# EAGLE design dc26_maneki-neko_badge_VERSION2 (EAGLE 9.1.3)
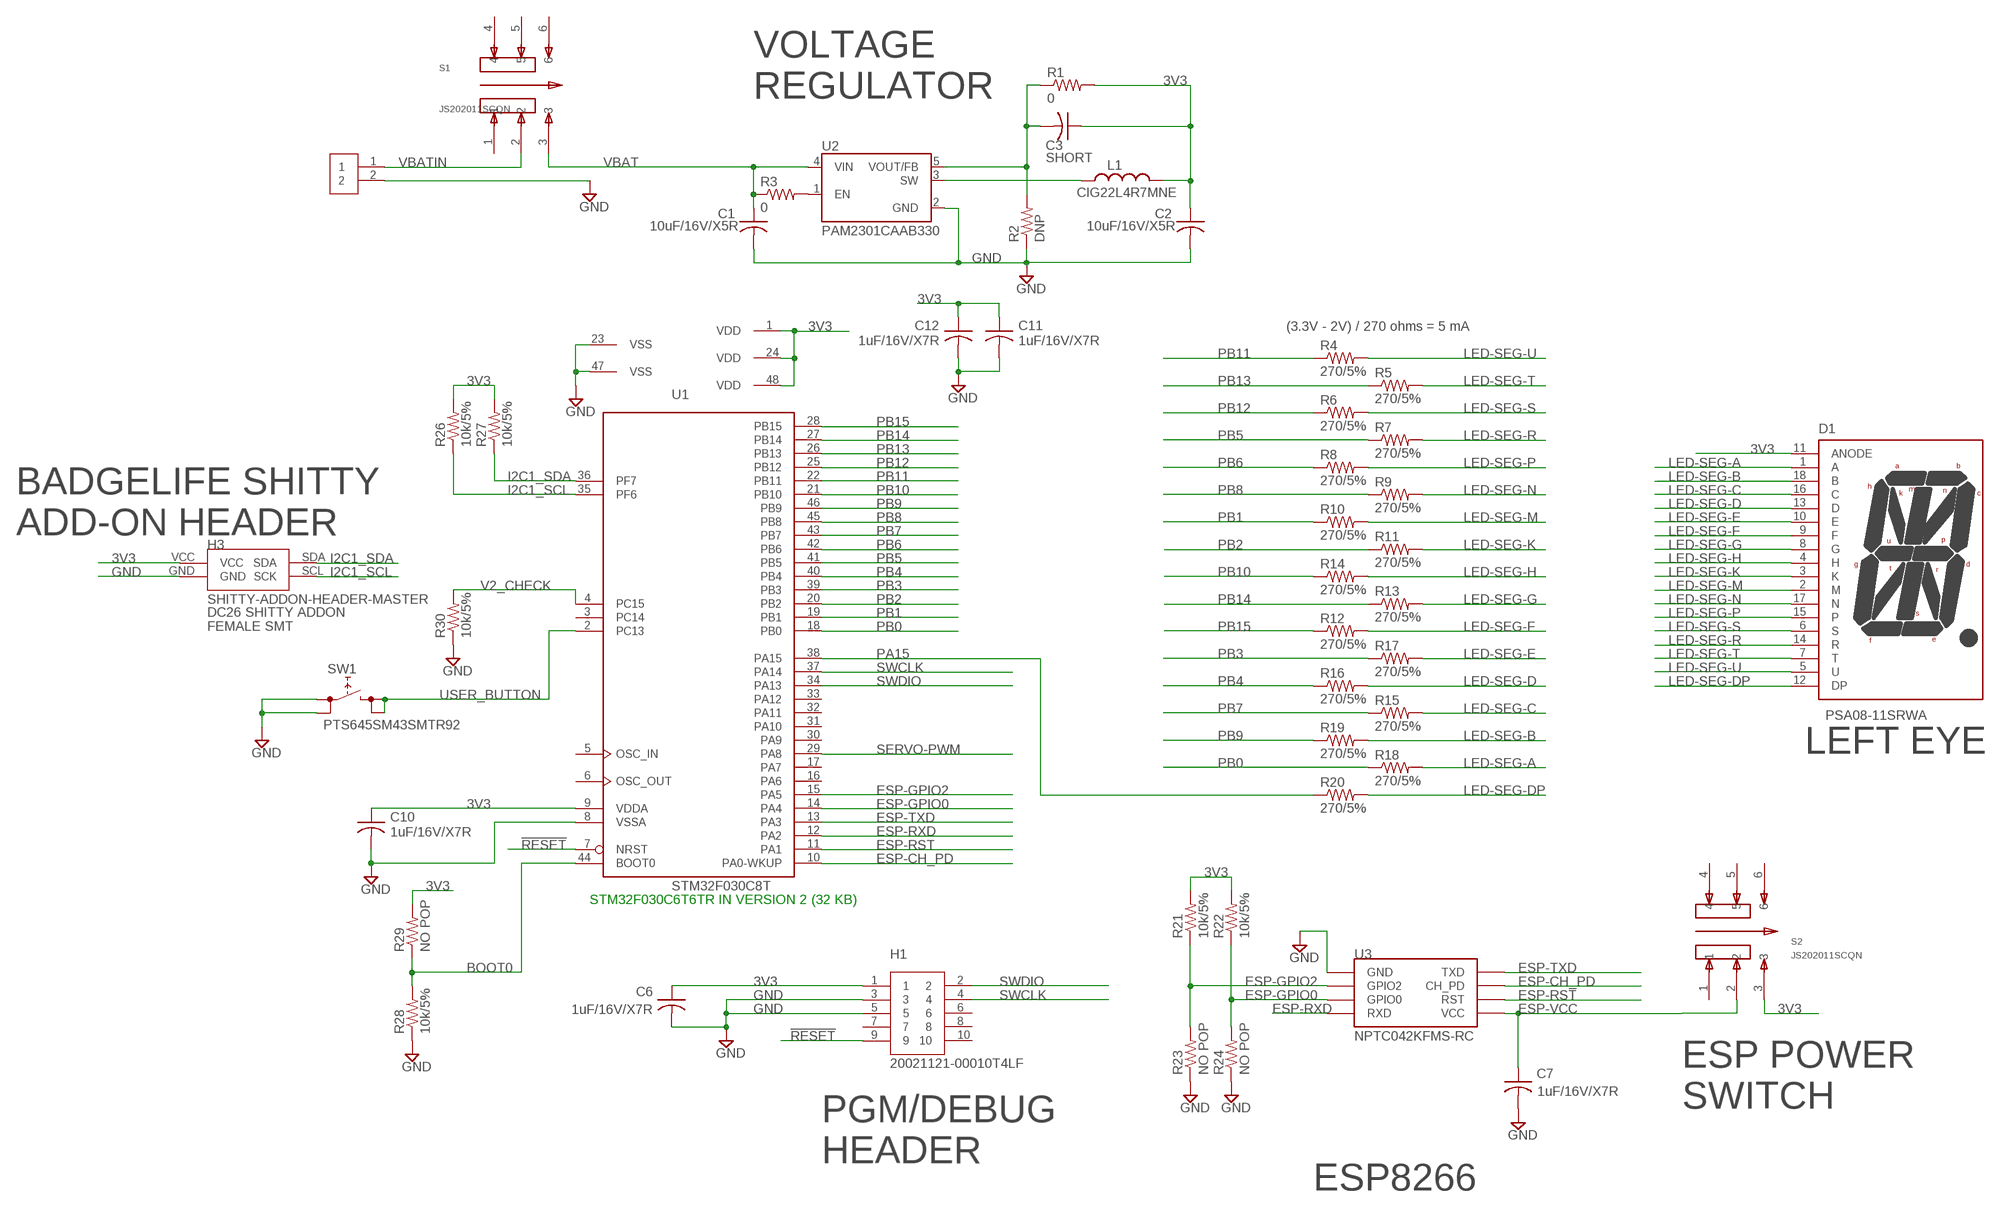
[diagram p0: schematic, sheet 1, part 1 of 2]
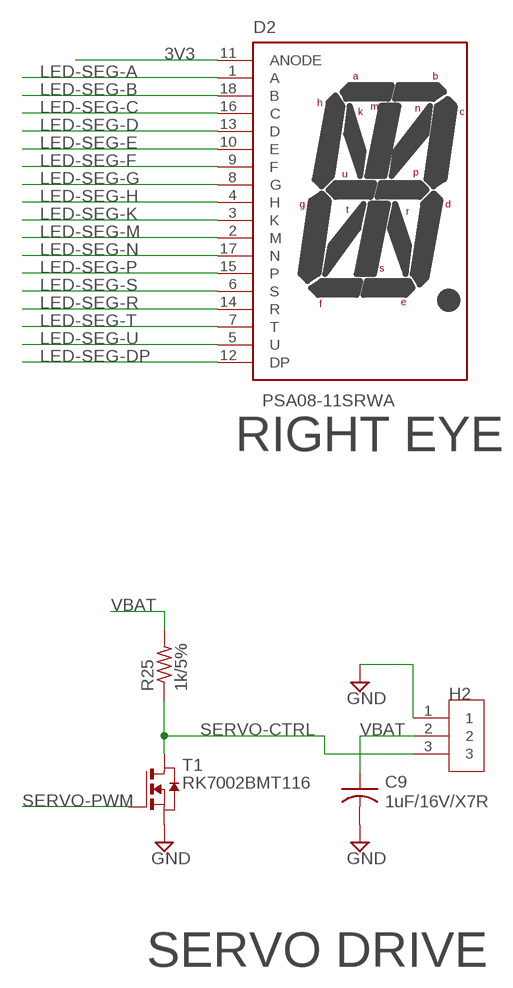
[diagram p1: schematic, sheet 1, part 2 of 2]

## Parts
C1  10uF/16V/X5R  C-USC0805  [C0805]
C2  10uF/16V/X5R  C-USC0805  [C0805]
C3  SHORT  C-USC0805  [C0805]
C6  1uF/16V/X7R  C-USC0805  [C0805]
C7  1uF/16V/X7R  C-USC0805  [C0805]
C9  1uF/16V/X7R  C-USC0805  [C0805]
C10  1uF/16V/X7R  C-USC0805  [C0805]
C11  1uF/16V/X7R  C-USC0805  [C0805]
C12  1uF/16V/X7R  C-USC0805  [C0805]
D1  PSA08-11SRWA  [PSA08-11SRWA]
D2  PSA08-11SRWA  [PSA08-11SRWA]
H1  20021121-00010T4LF  [20021121-00010T4LF]
H2  M20-8890345R  [M20-8890345R]
H3  SHITTY-ADDON-HEADER-MASTER  [2X2-0.1INCH-FEMALE-SMT]
H4  BATTPADS-SMT  [BATTPADS-SMT]
L1  CIG22L4R7MNE  [L-1008-US]
R1  0  R-US_R0805  [R0805]
R2  DNP  R-US_R0805  [R0805]
R3  0  R-US_R0805  [R0805]
R4  270/5%  R-US_R0805  [R0805]
R5  270/5%  R-US_R0805  [R0805]
R6  270/5%  R-US_R0805  [R0805]
R7  270/5%  R-US_R0805  [R0805]
R8  270/5%  R-US_R0805  [R0805]
R9  270/5%  R-US_R0805  [R0805]
R10  270/5%  R-US_R0805  [R0805]
R11  270/5%  R-US_R0805  [R0805]
R12  270/5%  R-US_R0805  [R0805]
R13  270/5%  R-US_R0805  [R0805]
R14  270/5%  R-US_R0805  [R0805]
R15  270/5%  R-US_R0805  [R0805]
R16  270/5%  R-US_R0805  [R0805]
R17  270/5%  R-US_R0805  [R0805]
R18  270/5%  R-US_R0805  [R0805]
R19  270/5%  R-US_R0805  [R0805]
R20  270/5%  R-US_R0805  [R0805]
R21  10k/5%  R-US_R0805  [R0805]
R22  10k/5%  R-US_R0805  [R0805]
R23  NO POP  R-US_R0805  [R0805]
R24  NO POP  R-US_R0805  [R0805]
R25  1k/5%  R-US_R0805  [R0805]
R26  10k/5%  R-US_R0805  [R0805]
R27  10k/5%  R-US_R0805  [R0805]
R28  10k/5%  R-US_R0805  [R0805]
R29  NO POP  R-US_R0805  [R0805]
R30  10k/5%  R-US_R0805  [R0805]
S1  JS202011SCQN  [SW_JS202011SCQN]
S2  JS202011SCQN  [SW_JS202011SCQN]
SW1  PTS645SM43SMTR92  [PTS645SM43SMTR92]
T1  RK7002BMT116  NMOSSOT23  [SOT-23]
U1  STM32F030C8T  [LQFP48]
U2  PAM2301CAAB330  [SOT95P280X100-5N]
U3  NPTC042KFMS-RC  [NPTC042KFMS-RC]

## Nets
3V3: C2.1 C3.1 C6.1 C10.1 C11.1 C12.1 D1.11(ANODE) D2.11(ANODE) H1.1 H3.VCC L1.P$2 R1.2 R21.2 R22.2 R26.2 R27.2 R29.2 S2.3 U1.1(VDD) U1.9(VDDA) U1.24(VDD) U1.48(VDD)
!RESET: H1.9 U1.7(NRST)
BOOT0: R28.2 R29.1 U1.44(BOOT0)
ESP-CH_PD: U1.10(PA0-WKUP) U3.3(CH_PD)
ESP-GPIO0: R22.1 R24.2 U1.14(PA4) U3.6(GPIO0)
ESP-GPIO2: R21.1 R23.2 U1.15(PA5) U3.4(GPIO2)
ESP-RST: U1.11(PA1) U3.5(RST)
ESP-RXD: U1.12(PA2) U3.8(RXD)
ESP-TXD: U1.13(PA3) U3.1(TXD)
ESP-VCC: C7.1 S2.2 U3.7(VCC)
GND: C1.2 C2.2 C6.2 C7.2 C9.2 C10.2 C11.2 C12.2 H1.3 H1.5 H2.1 H3.GND H4.2 R2.1 R23.1 R24.1 R28.1 R30.1 SW1.1 SW1.2 T1.2(S) U1.8(VSSA) U1.23(VSS) U1.47(VSS) U2.2(GND) U3.2(GND)
I2C1_SCL: H3.SCL(SCK) R26.1 U1.35(PF6)
I2C1_SDA: H3.SDA R27.1 U1.36(PF7)
LED-SEG-A: D1.1(A) D2.1(A) R18.2
LED-SEG-B: D1.18(B) D2.18(B) R19.2
LED-SEG-C: D1.16(C) D2.16(C) R15.2
LED-SEG-D: D1.13(D) D2.13(D) R16.2
LED-SEG-DP: D1.12(DP) D2.12(DP) R20.2
LED-SEG-E: D1.10(E) D2.10(E) R17.2
LED-SEG-F: D1.9(F) D2.9(F) R12.2
LED-SEG-G: D1.8(G) D2.8(G) R13.2
LED-SEG-H: D1.4(H) D2.4(H) R14.2
LED-SEG-K: D1.3(K) D2.3(K) R11.2
LED-SEG-M: D1.2(M) D2.2(M) R10.2
LED-SEG-N: D1.17(N) D2.17(N) R9.2
LED-SEG-P: D1.15(P) D2.15(P) R8.2
LED-SEG-R: D1.14(R) D2.14(R) R7.2
LED-SEG-S: D1.6(S) D2.6(S) R6.2
LED-SEG-T: D1.7(T) D2.7(T) R5.2
LED-SEG-U: D1.5(U) D2.5(U) R4.2
N$1: L1.P$1 U2.3(SW)
N$2: R3.2 U2.1(EN)
N$3: C3.2 R1.1 R2.2 U2.5(VOUT/FB)
PA15: R20.1 U1.38(PA15)
PB0: R18.1 U1.18(PB0)
PB1: R10.1 U1.19(PB1)
PB2: R11.1 U1.20(PB2)
PB3: R17.1 U1.39(PB3)
PB4: R16.1 U1.40(PB4)
PB5: R7.1 U1.41(PB5)
PB6: R8.1 U1.42(PB6)
PB7: R15.1 U1.43(PB7)
PB8: R9.1 U1.45(PB8)
PB9: R19.1 U1.46(PB9)
PB10: R14.1 U1.21(PB10)
PB11: R4.1 U1.22(PB11)
PB12: R6.1 U1.25(PB12)
PB13: R5.1 U1.26(PB13)
PB14: R13.1 U1.27(PB14)
PB15: R12.1 U1.28(PB15)
SERVO-CTRL: H2.3 R25.1 T1.1(D)
SERVO-PWM: T1.3(G) U1.29(PA8)
SWCLK: H1.4 U1.37(PA14)
SWDIO: H1.2 U1.34(PA13)
USER_BUTTON: SW1.3 SW1.4 U1.2(PC13)
V2_CHECK: R30.2 U1.4(PC15)
VBAT: C1.1 C9.1 H2.2 R3.1 R25.2 S1.3 U2.4(VIN)
VBATIN: H4.1 S1.2
Unconnected: H1.6 H1.7 H1.8 H1.10 S1.1 S1.4 S1.5 S1.6 S2.1 S2.4 S2.5 S2.6 U1.3(PC14) U1.5(OSC_IN) U1.6(OSC_OUT) U1.16(PA6) U1.17(PA7) U1.30(PA9) U1.31(PA10) U1.32(PA11) U1.33(PA12)

## Notes on the sheet
- VOLTAGE
  REGULATOR
- (3.3V - 2V) / 270 ohms = 5 mA
- BADGELIFE SHITTY
  ADD-ON HEADER
- LEFT EYE | RIGHT EYE
- STM32F030C6T6TR IN VERSION 2 (32 KB)
- ESP POWER
  SWITCH
- SERVO DRIVE
- PGM/DEBUG
  HEADER
- ESP8266

## Library data of the parts
C1-C3 C6 C7 C9-C12 = rcl:C-US: CAPACITOR, American symbol; SPICEPREFIX: C
D1 D2 = PSA08-11SRWA:PSA08-11SRWA
H1 = 20021121-00010T4LF:20021121-00010T4LF
H2 = M20-8890345R:M20-8890345R
H3 = dc26-shitty-addon:SHITTY-ADDON-HEADER-MASTER
H4 = battery_pads:BATTPADS-SMT
L1 = passives:CIG22L4R7MNE
R1-R30 = rcl:R-US_: RESISTOR, American symbol; SPICEPREFIX: R
S1 S2 = JS202011SCQN:JS202011SCQN: JS Series DPDT On-On Gull Wing Surface Mount Subminiature Slide Switch; AVAILABILITY: Good; DESCRIPTION: JS Series DPDT On-On Gull Wing Surface Mount Subminiature Slide Switch; MF: C&K Components; MP: JS202011SCQN; PACKAGE: None; PRICE: 0.33 USD
SW1 = PTS645SM43SMTR92:PTS645SM43SMTR92
T1 = zetex:NMOSSOT23: MOS FET; OC_FARNELL: unknown; OC_NEWARK: unknown
U1 = micro-stm_v3:STM32F030C*T: ARM 32-bit Cortex™-M0 CPU 48 MHz maximum frequency 32 to 64 Kbytes of Flash memory 4 to 8 kbytes of SRAM 39 GPIOs 2.4 to 3.6 V application supply
U2 = PAM2301CAAB120:PAM2301CAAB330
U3 = NPTC042KFMS-RC:NPTC042KFMS-RC

## Board
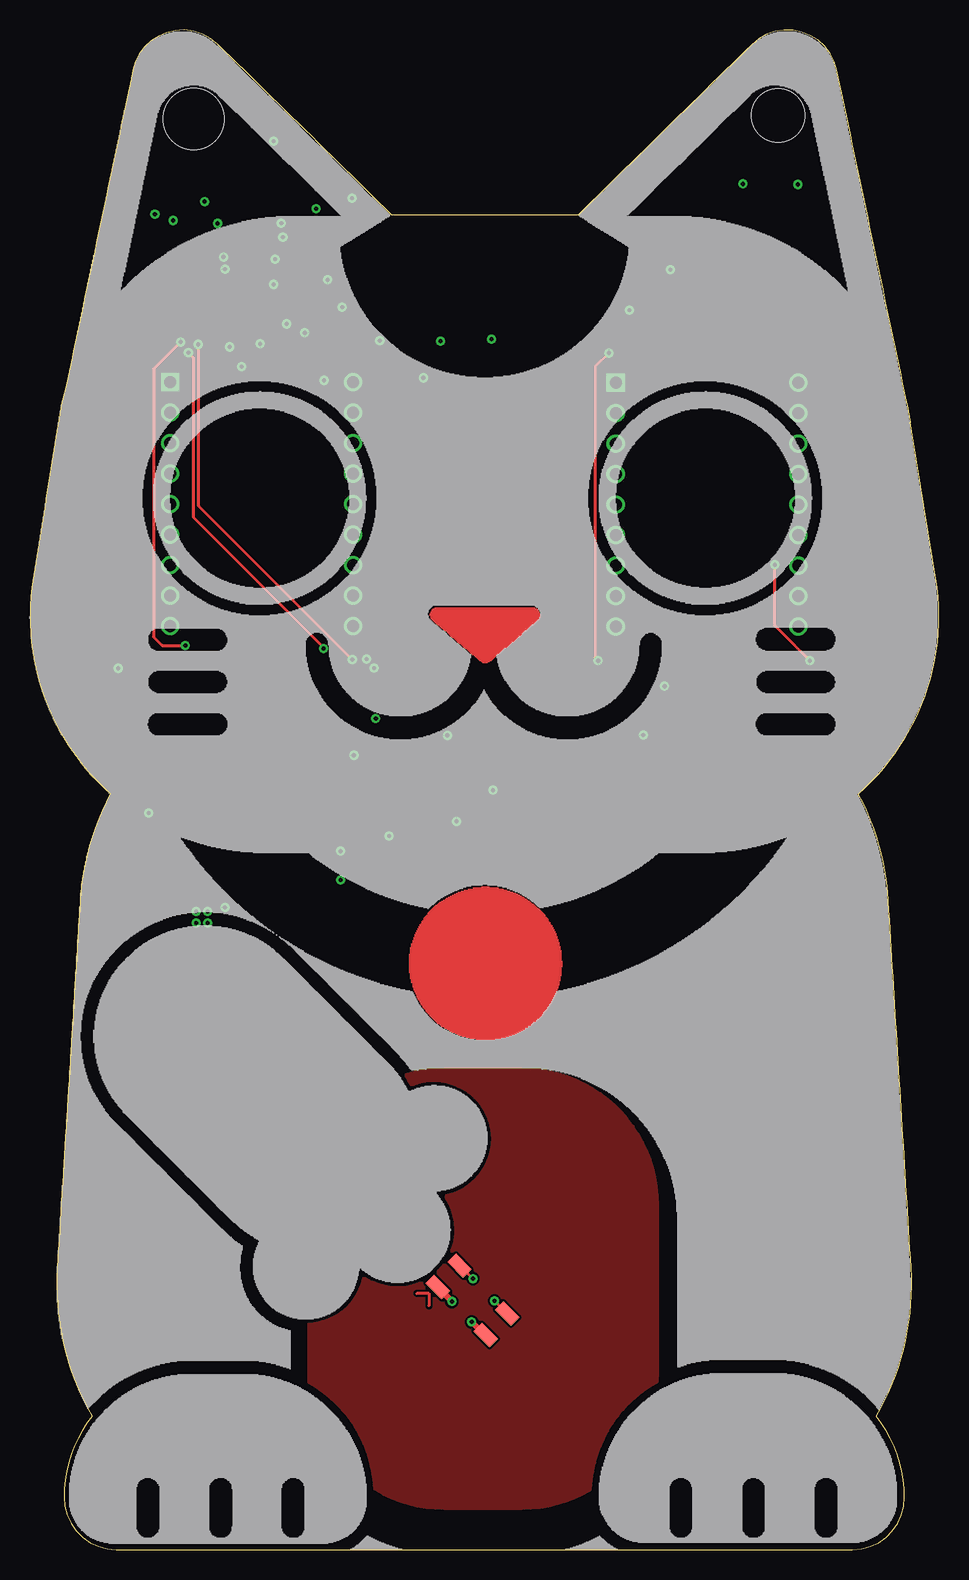
[diagram p2: board, top side]
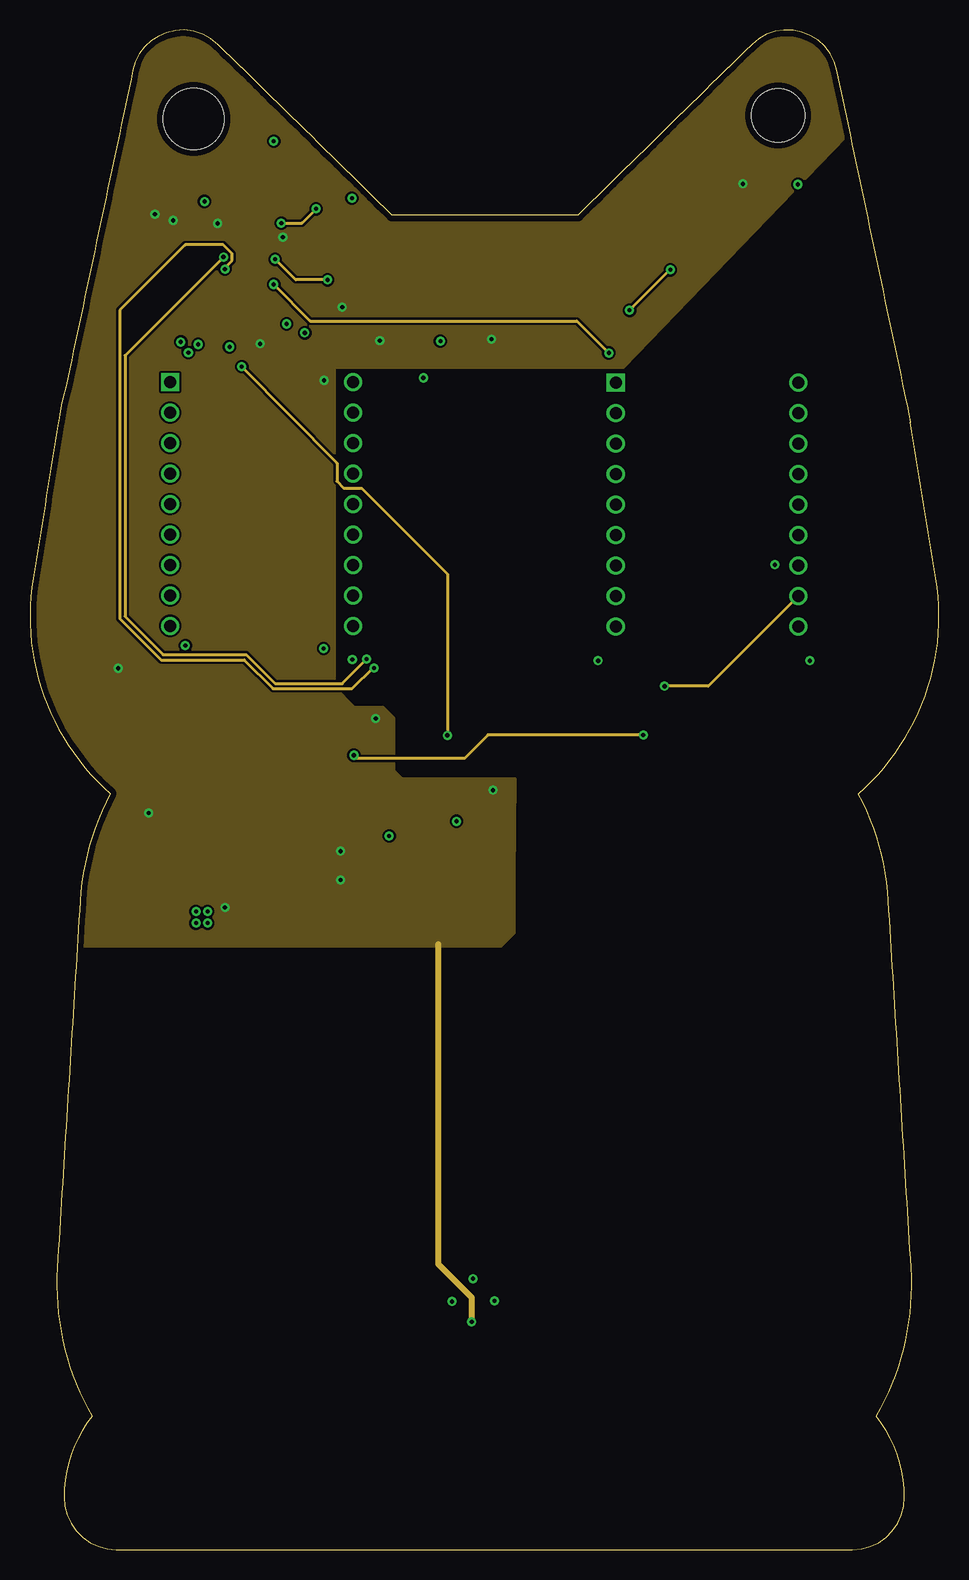
[diagram p3: board, inner layer 3v3]
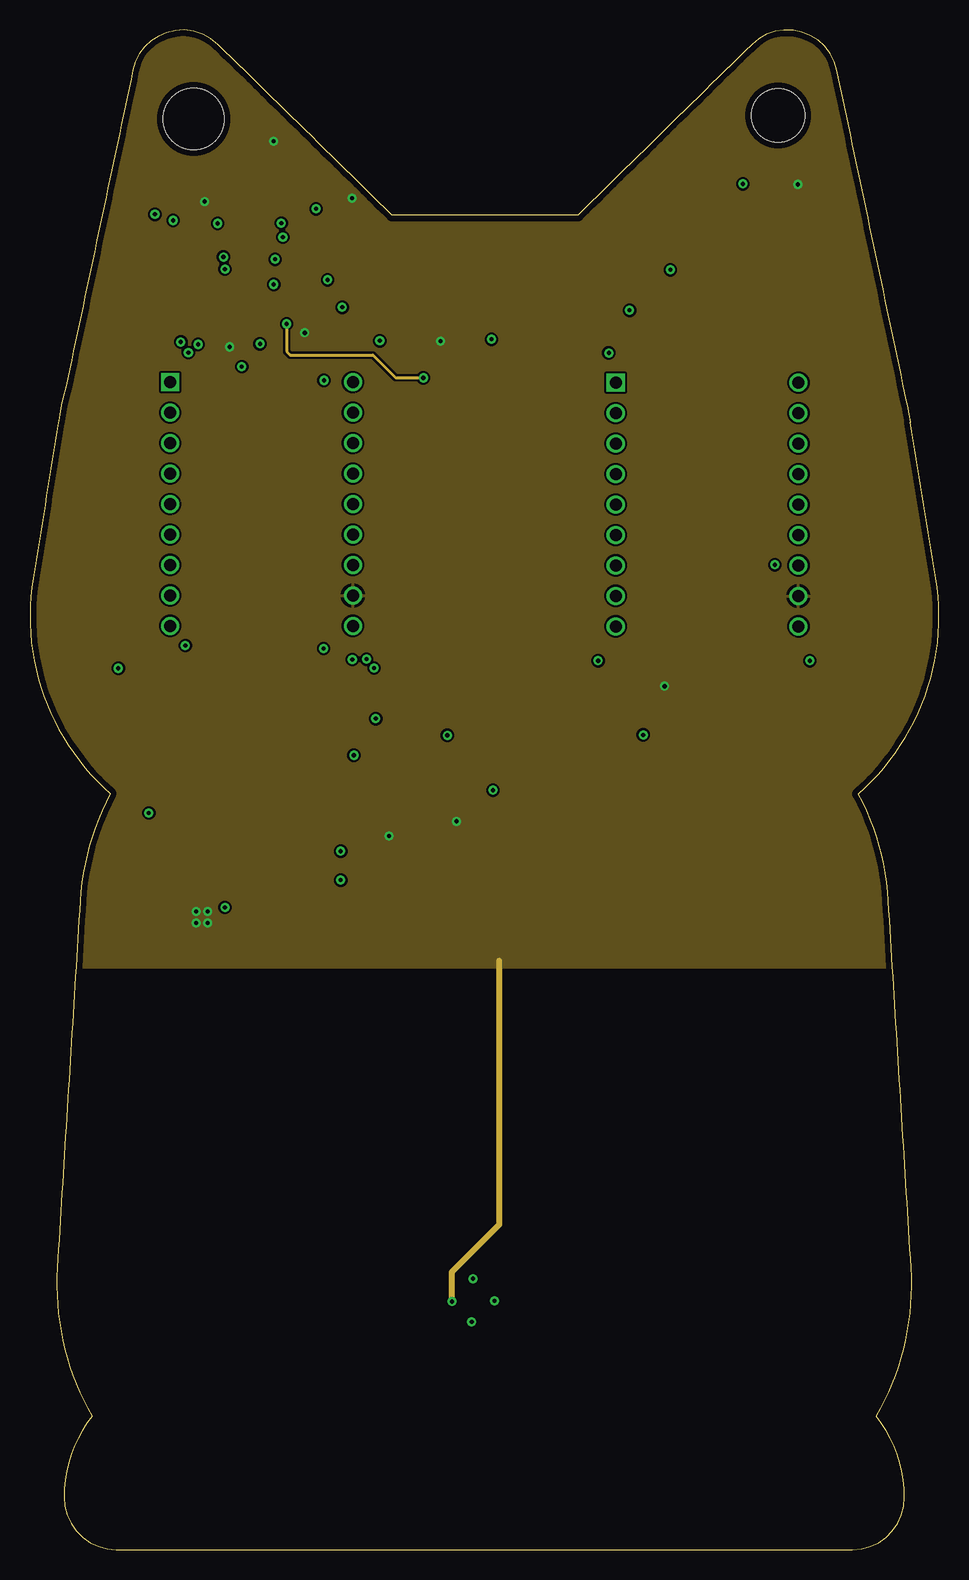
[diagram p4: board, inner layer gnd]
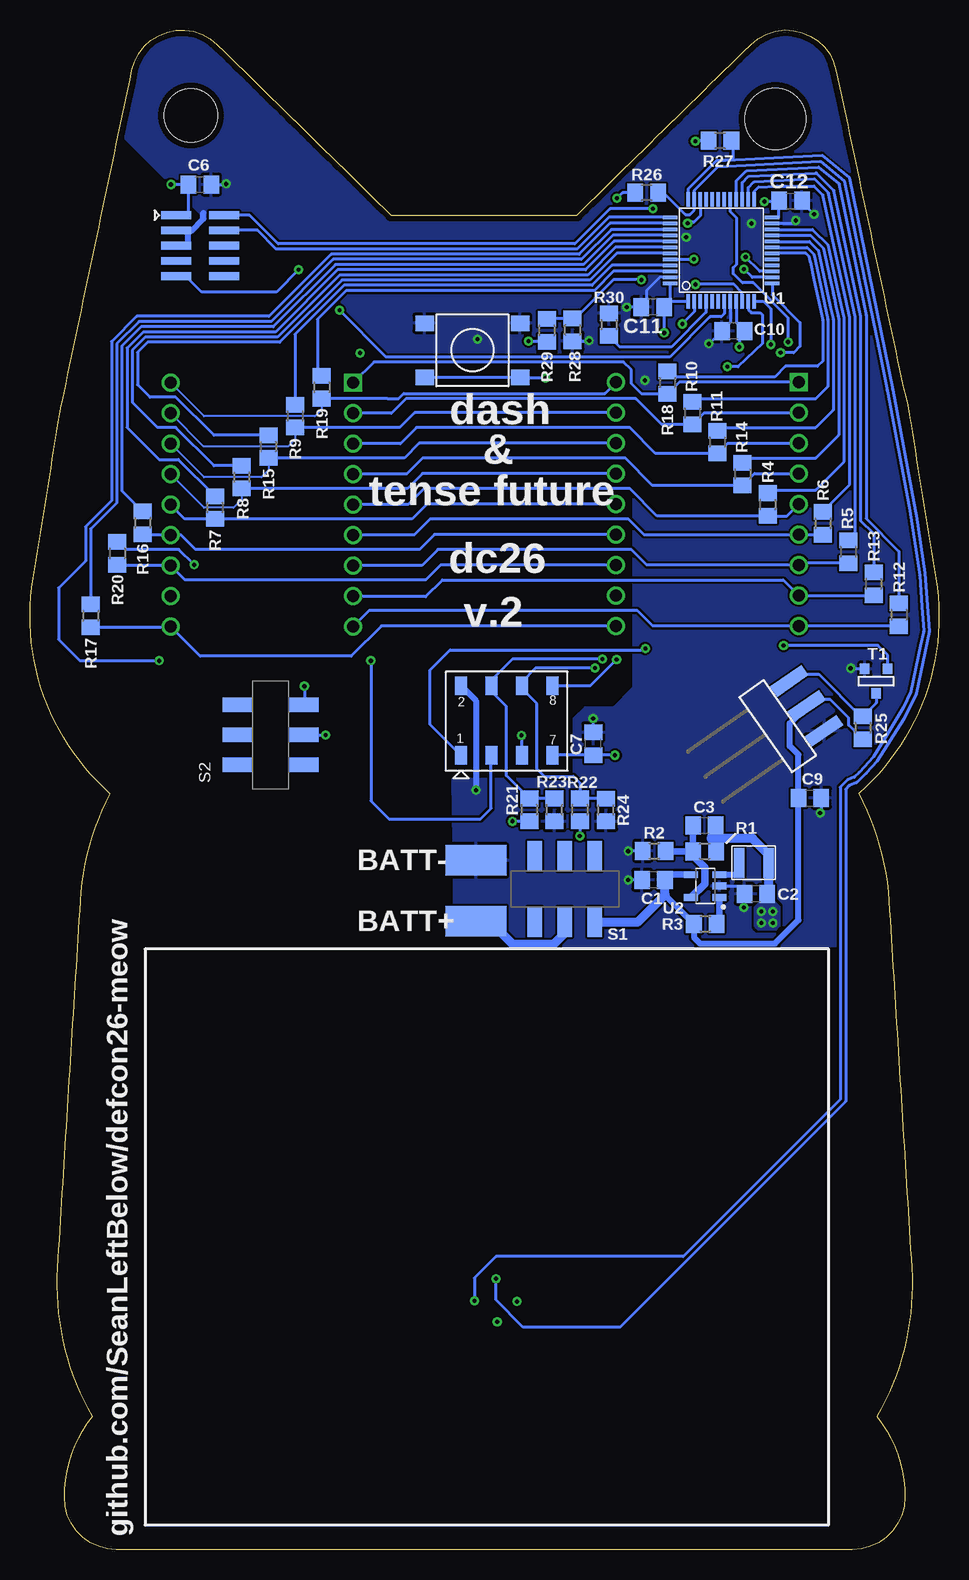
[diagram p5: board, bottom side, seen from below]

Size 75.79 x 126.67 mm. Coordinates in mm from the lower left corner, seen from the top.
Outline: 12.85,126.67 12.11,126.63 11.4,126.46 10.72,126.17 10.1,125.77 9.56,125.27 9.12,124.68 8.79,124.02 8.58,123.32 8.42,122.56 8.26,121.81 8.1,121.05 7.94,120.29 7.78,119.54 7.62,118.78 7.46,118.03 7.3,117.27 7.14,116.52 6.98,115.76 6.82,115.01 6.66,114.25 6.5,113.5 6.34,112.74 6.18,111.98 6.02,111.23 5.86,110.47 5.7,109.72 5.54,108.96 5.38,108.21 5.22,107.45 5.06,106.7 4.9,105.94 4.74,105.18 4.58,104.43 4.42,103.67 4.26,102.92 4.1,102.16 3.94,101.41 3.78,100.65 3.62,99.9 3.46,99.14 3.3,98.39 3.14,97.63 2.98,96.87 2.78,96.13 2.62,95.38 2.48,94.63 2.4,94.13 2.36,93.94 2.37,93.95 2.24,93.18 2.12,92.42 2,91.66 1.87,90.9 1.75,90.13 1.62,89.37 1.5,88.61 1.37,87.84 1.25,87.08 1.13,86.32 1,85.55 0.88,84.79 0.75,84.03 0.63,83.26 0.5,82.5 0.38,81.73 0.26,80.97 0.15,80.21 0.07,79.45 0.02,78.69 0,77.92 0.01,77.16 0.05,76.39 0.12,75.63 0.22,74.87 0.35,74.11 0.51,73.37 0.69,72.62 0.91,71.89 1.16,71.16 1.43,70.45 1.73,69.74 2.06,69.05 2.41,68.37 2.8,67.71 3.2,67.06 3.63,66.43 4.09,65.81 4.56,65.21 5.07,64.63 5.59,64.07 6.13,63.53 6.69,63.01 6.34,62.32 6.01,61.61 5.71,60.89 5.43,60.16 5.18,59.42 4.96,58.67 4.76,57.92 4.59,57.15 4.44,56.39 4.33,55.62 4.24,54.84 4.18,54.06 4.13,53.28 4.08,52.49 4.03,51.71 3.98,50.92 3.93,50.14 3.88,49.36 3.83,48.57 3.79,47.79 3.74,47 3.69,46.22 3.64,45.43 3.59,44.65 3.54,43.87 3.49,43.08 3.45,42.3 3.4,41.51 3.35,40.73 3.3,39.94 3.25,39.16 3.2,38.38 3.15,37.59 3.1,36.81 3.06,36.02 3.01,35.24 2.96,34.45 2.91,33.67 2.86,32.89 2.81,32.1 2.76,31.32 2.71,30.53 2.67,29.75 2.62,28.97 2.57,28.18 2.52,27.4 2.47,26.61 2.42,25.83 2.37,25.04 2.33,24.26 2.28,23.48 2.24,22.72 2.24,21.96 2.25,21.2 2.3,20.44 2.37,19.69 2.46,18.94 2.59,18.19 2.73,17.44 2.91,16.71 3.1,15.97 3.33,15.25 3.58,14.53 3.85,13.83 4.15,13.13 4.47,12.44 4.81,11.76 5.18,11.1 4.75,10.52 4.36,9.9 4.01,9.27 3.7,8.61 3.44,7.93 3.23,7.24 3.06,6.53 2.94,5.81 2.87,5.09 2.84,4.36 2.91,3.61 3.1,2.87 3.42,2.18 3.86,1.55 4.4,1.02 5.02,0.58 5.71,0.26 6.45,0.06 7.21,0 68.58,0 69.34,0.07 70.07,0.26 70.76,0.58 71.38,1.02 71.91,1.56 72.35,2.18 72.66,2.87 72.85,3.61 72.91,4.36 72.88,5.09 72.81,5.81 72.69,6.53 72.52,7.24 72.31,7.93 72.05,8.61 71.74,9.27 71.39,9.9 71,10.52 70.57,11.1 70.94,11.77 71.28,12.44 71.6,13.13 71.9,13.83 72.17,14.53 72.42,15.25 72.64,15.97 72.84,16.71 73.01,17.44 73.16,18.19 73.28,18.94 73.38,19.69 73.45,20.44 73.49,21.2 73.51,21.96 73.5,22.72 73.47,23.48 73.42,24.26 73.37,25.04 73.32,25.83 73.28,26.61 73.23,27.4 73.18,28.18 73.13,28.96 73.08,29.75 73.03,30.53 72.98,31.32 72.93,32.1 72.89,32.89 72.84,33.67 72.79,34.45 72.74,35.24 72.69,36.02 72.64,36.81 72.59,37.59 72.55,38.38 72.5,39.16 72.45,39.94 72.4,40.73 72.35,41.51 72.3,42.3 72.25,43.08 72.2,43.87 72.16,44.65 72.11,45.43 72.06,46.22 72.01,47 71.96,47.79 71.91,48.57 71.86,49.36 71.81,50.14 71.77,50.92 71.72,51.71 71.67,52.49 71.62,53.28 71.57,54.06 71.51,54.84 71.43,55.61 71.31,56.38 71.17,57.15 71,57.91 70.81,58.67 70.58,59.41 70.33,60.15 70.06,60.88 69.76,61.6 69.43,62.31 69.08,63 69.65,63.52 70.19,64.06 70.71,64.62 71.21,65.2 71.69,65.8 72.15,66.42 72.58,67.05 72.99,67.7 73.37,68.37 73.72,69.04 74.05,69.74 74.35,70.44 74.63,71.16 74.87,71.88 75.09,72.62 75.28,73.36 75.44,74.11 75.57,74.87 75.67,75.63 75.74,76.39 75.78,77.15 75.79,77.92 75.77,78.69 75.72,79.45 75.64,80.21 75.53,80.97 75.41,81.74 75.28,82.5 75.16,83.27 75.03,84.03 74.91,84.8 74.78,85.56 74.66,86.33 74.54,87.09 74.41,87.86 74.29,88.62 74.16,89.39 74.04,90.15 73.91,90.92 73.79,91.68 73.66,92.45 73.54,93.21 73.42,93.98 73.42,93.99 73.32,94.66 73.17,95.37 73.11,95.65 72.95,96.42 72.79,97.19 72.63,97.96 72.46,98.73 72.3,99.5 72.14,100.26 71.98,101.03 71.82,101.8 71.65,102.57 71.49,103.34 71.33,104.11 71.17,104.87 71.01,105.64 70.85,106.41 70.68,107.18 70.52,107.95 70.36,108.72 70.2,109.49 70.04,110.25 69.88,111.02 69.71,111.79 69.55,112.56 69.39,113.33 69.23,114.1 69.07,114.86 68.91,115.63 68.74,116.4 68.58,117.17 68.42,117.94 68.26,118.71 68.1,119.47 67.94,120.24 67.77,121.01 67.61,121.78 67.45,122.55 67.29,123.32 67.07,124.04 66.73,124.71 66.27,125.31 65.71,125.82 65.07,126.21 64.37,126.49 63.63,126.65 62.87,126.67 62.13,126.56 61.42,126.31 60.76,125.94 60.18,125.46 59.62,124.91 59.06,124.36 58.5,123.82 57.95,123.27 57.39,122.72 56.83,122.18 56.27,121.63 55.71,121.08 55.16,120.53 54.6,119.99 54.04,119.44 53.48,118.89 52.92,118.35 52.37,117.8 51.81,117.25 51.25,116.71 50.69,116.16 50.13,115.61 49.58,115.06 49.02,114.52 48.46,113.97 47.9,113.42 47.35,112.88 46.79,112.33 46.23,111.78 45.67,111.24 30.2,111.24 29.64,111.78 29.08,112.33 28.52,112.88 27.96,113.42 27.41,113.97 26.85,114.52 26.29,115.07 25.73,115.61 25.18,116.16 24.62,116.71 24.06,117.25 23.5,117.8 22.94,118.35 22.39,118.89 21.83,119.44 21.27,119.99 20.71,120.53 20.15,121.08 19.6,121.63 19.04,122.18 18.48,122.72 17.92,123.27 17.36,123.82 16.81,124.36 16.25,124.91 15.69,125.46 15.08,125.96 14.39,126.34 13.63,126.58 12.85,126.67
Copper layers (1*2*15*16): Top 0.035mm / dielectric 0.5mm / 3v3 0.035mm / dielectric 0.5mm / gnd 0.035mm / dielectric 0.5mm / Bottom 0.035mm
Design rules "default *": minimum track width 6mil, minimum drill 12mil, track to track 7mil, track to pad 8mil, pad to pad 7mil, via to via 8mil, smd to smd 0mil, copper to edge 20mil, drill to drill 8mil, minimum pad ring 10mil, minimum via ring 8mil, stop-mask expansion 4mil, vias tented up to drill 14mil, thermal gap 10mil
Holes 5.08 mm at 13.64,119.26
Holes 4.45 mm at 62.36,119.56
bKeepout: area 9.2,2.1 to 66.2,50.1

### Footprints (pad centres in the part's own frame; a part is rotated, then mirrored left to right if it is on the bottom)
C0805 = smd 1.3 x 1.5: 1 -0.95,0; 2 0.95,0
PSA08-11SRWA = drill 1 square: 1 -7.62,10.16 | drill 1: 2 -7.62,7.62; 3 -7.62,5.08; 4 -7.62,2.54; 5 -7.62,0; 6 -7.62,-2.54; 7 -7.62,-5.08; 8 -7.62,-7.62; 9 -7.62,-10.16; 10 7.62,-10.16; 11 7.62,-7.62; 12 7.62,-5.08; 13 7.62,-2.54; 14 7.62,0; 15 7.62,2.54; 16 7.62,5.08; 17 7.62,7.62; 18 7.62,10.16
20021121-00010T4LF = smd 0.65 x 2.5: 1 0,0; 2 0,4; 3 1.27,0; 4 1.27,4; 5 2.54,0; 6 2.54,4; 7 3.81,0; 8 3.81,4; 9 5.08,0; 10 5.08,4
M20-8890345R = smd 3.17 x 1.02: 1 0,0; 2 0,-2.54; 3 0,-5.08
2X2-0.1INCH-FEMALE-SMT = smd 1 x 1.85: GND 0,0; SCL 2.54,0; SDA 2.54,5.65; VCC 0,5.65
BATTPADS-SMT = smd 2.54 x 5.08: 1 0,0; 2 5.08,0
L-1008-US = smd 0.85 x 2.5: P$1 0,0; P$2 2.45,0
R0805 = smd 1.3 x 1.5: 1 -0.95,0; 2 0.95,0
SW_JS202011SCQN = smd 1.2 x 2.5: 1 -2.5,-2.75; 2 0,-2.75; 3 2.5,-2.75; 4 -2.5,2.75; 5 0,2.75; 6 2.5,2.75
PTS645SM43SMTR92 = smd 1.55 x 1.3: 1 -3.975,2.25; 2 3.975,2.25; 3 -3.975,-2.25; 4 3.975,-2.25
SOT-23 = smd 0.787 x 0.889: 1 0.025,-1.016; 2 -0.94,1.016; 3 0.991,1.016
LQFP48 = smd 0.3 x 1.2: 1 -2.75,-4.25; 2 -2.25,-4.25; 3 -1.75,-4.25; 4 -1.25,-4.25; 5 -0.75,-4.25; 6 -0.25,-4.25; 7 0.25,-4.25; 8 0.75,-4.25; 9 1.25,-4.25; 10 1.75,-4.25; 11 2.25,-4.25; 12 2.75,-4.25; 25 2.75,4.25; 26 2.25,4.25; 27 1.75,4.25; 28 1.25,4.25; 29 0.75,4.25; 30 0.25,4.25; 31 -0.25,4.25; 32 -0.75,4.25; 33 -1.25,4.25; 34 -1.75,4.25; 35 -2.25,4.25; 36 -2.75,4.25 | smd 1.2 x 0.3: 13 4.25,-2.75; 14 4.25,-2.25; 15 4.25,-1.75; 16 4.25,-1.25; 17 4.25,-0.75; 18 4.25,-0.25; 19 4.25,0.25; 20 4.25,0.75; 21 4.25,1.25; 22 4.25,1.75; 23 4.25,2.25; 24 4.25,2.75; 37 -4.25,2.75; 38 -4.25,2.25; 39 -4.25,1.75; 40 -4.25,1.25; 41 -4.25,0.75; 42 -4.25,0.25; 43 -4.25,-0.25; 44 -4.25,-0.75; 45 -4.25,-1.25; 46 -4.25,-1.75; 47 -4.25,-2.25; 48 -4.25,-2.75
SOT95P280X100-5N = smd 1.24 x 0.55: 1 -1.185,0.95; 2 -1.185,0; 3 -1.185,-0.95; 4 1.185,-0.95; 5 1.185,0.95
NPTC042KFMS-RC = smd 0.991 x 1.549: 1 0,0; 2 0,5.817; 3 2.54,0; 4 2.54,5.817; 5 5.08,0; 6 5.08,5.817; 7 7.62,0; 8 7.62,5.817

### Placement (x,y rotation side)
C1  23.8,55.83 180 bottom
C2  15.26,54.66 180 bottom
C3  19.56,60.35 180 bottom
C6  61.62,113.8 0 bottom
C7  28.82,67.18 90 bottom
C9  10.77,62.66 0 bottom
C10  17.14,101.58 180 bottom
C11  23.88,103.56 180 bottom
C12  12.37,112.43 0 bottom
D1  19.3,87.16 0 top
D2  56.45,87.12 0 top
H1  63.61,111.24 270 bottom
H2  9.58,68.26 215 bottom
H3  38,17.89 45 top
H4  38.6,52.38 90 bottom
L1  16.66,57.25 0 bottom
R1  19.53,58.21 0 bottom
R2  23.74,58.25 0 bottom
R3  19.48,52.17 0 bottom
R4  14.29,87.12 270 bottom
R5  7.56,83.18 270 bottom
R6  9.68,85.54 270 bottom
R7  60.36,86.86 270 bottom
R8  58.14,89.4 270 bottom
R9  53.68,94.48 270 bottom
R10  20.56,94.74 270 bottom
R11  18.47,92.32 270 bottom
R12  3.33,77.92 270 bottom
R13  5.45,80.51 270 bottom
R14  16.38,89.66 270 bottom
R15  55.91,91.94 270 bottom
R16  66.4,85.59 270 bottom
R17  70.73,77.85 270 bottom
R18  22.65,97.28 270 bottom
R19  51.46,96.9 270 bottom
R20  68.5,83.05 270 bottom
R21  34.16,61.67 270 bottom
R22  29.95,61.67 270 bottom
R23  32.06,61.67 90 bottom
R24  27.76,61.65 90 bottom
R25  6.35,68.51 270 bottom
R26  24.38,113.11 180 bottom
R27  18.26,117.46 180 bottom
R28  30.54,101.68 90 bottom
R29  32.7,101.64 270 bottom
R30  27.51,102.11 270 bottom
S1  31.2,55.08 0 bottom
S2  55.7,67.91 90 bottom
SW1  38.9,99.98 0 bottom
T1  5.26,72.4 0 bottom
U1  18.15,108.31 0 bottom
U2  19.48,55.32 180 bottom
U3  39.86,66.21 0 bottom

### Tracks (layer width: path | path; a pad name or v marks a point on that pad's centre or on a via)
3V3  (via drill 0.35)
  Top 0.508: v35.18,20.68 34.01,21.85 H3.VCC
  3v3 0.254: D2.11 56.55,71.97 v52.91,71.97
  gnd 0.508: 39.12,49.1 39.12,27.08 35.15,23.12 35.15,20.68 v35.18,20.68
  Bottom 0.254: 22.43,104.06 C11.1 22.93,101.44 v22.91,101.43 | 22.43,104.06 U1.1 | U1.48 22.43,105.53 22.43,104.06 | v64.03,113.8 C6.1 62.57,111.32 62.69,111.21 62.72,111.24 H1.1 | R29.2 34.29,100.69 34.3,100.69 34.25,100.74 v34.22,100.74 | R26.2 26.39,113.11 v26.85,112.66 | U1.24 13.88,111.04 13.36,111.04 13.36,112.39 C12.1 13.37,112.38 v14.55,112.38 14.6,112.38 | U1.9 16.9,102.29 C10.1 16.64,101.14 v16.64,100.26 | R22.2 29.95,59.52 v29.95,59.49 | R21.2 35.61,60.72 35.61,60.71 v35.56,60.71 | R27.2 20.27,117.46 v20.32,117.41 | v52.91,71.97 52.91,70.45 S2.3
  Bottom 0.762: 18.87,59.29 15.54,59.29 14.21,57.96 L1.P$2 14.21,54.76 C2.1
  Bottom 1: 18.6,59.36 R1.2 | C3.1 18.6,59.36 | 18.87,59.29 18.6,59.36
  other vias: 13.84,53.19 14.81,53.19 14.81,52.23 13.84,52.23
  pour Bottom (no thermals): 13.66,53.93 13.33,53.6 13.33,53.02 13.33,52 13.64,51.7 15.04,51.7 15.29,51.95 15.29,53.58 14.93,53.93
  pour gnd: -1.78,48.57 77.6,48.57 77.6,77.91 77.6,127.69 4.32,127.69 -1.78,127.69
!RESET  (via drill 0.35)
  3v3 0.254: v49.99,103.31 53.36,106.69 v53.39,106.69
  Bottom 0.254: U1.7 17.9,103.04 18.16,102.78 19.09,102.78 22.44,99.42 46.1,99.42 v49.99,103.31 | H1.9 62.79,106.16 61.47,104.83 55.24,104.83 v53.39,106.69
BOOT0  (via drill 0.35)
  3v3 0.254: v24.82,105.85 22.15,105.85 v20.44,107.56 20.42,107.58
  Bottom 0.254: U1.44 v20.44,107.56 20.42,107.58 | v24.82,105.85 27.15,105.85 30.37,102.63 R28.2 32.66,102.63 R29.1
ESP-CH_PD  (via drill 0.35)
  Top 0.254: v48.26,99.75 47.12,98.61 47.12,74.35 v47.37,74.1
  3v3 0.254: v20.32,105.47 23.37,102.42 45.59,102.42 v48.26,99.75
  Bottom 0.254: U1.10 16.42,104.08 16.42,104.8 17.09,105.47 v20.32,105.47 | 37.32,65.74 U3.3 37.34,66.19 37.34,61.78 38.23,60.89 45.85,60.89 47.37,62.41 v47.37,74.1
ESP-GPIO0  (via drill 0.35)
  3v3 0.254: v16.26,106.74 16.26,106.88 16.84,107.46 16.84,108.05 16.11,108.77 12.95,108.77 7.49,103.31 7.49,77.6 10.92,74.17 17.85,74.17 20.27,71.76 26.85,71.76 28.68,73.59 28.7,73.59 28.7,73.5 v28.68,73.48
  Bottom 0.254: R24.2 R22.1 29.95,63.91 30.48,64.45 32.89,64.45 33.53,65.08 33.53,70.52 34.78,71.77 U3.6 34.78,72.34 33.63,73.48 v28.68,73.48 | U1.14 15.58,106.06 v16.26,106.74
ESP-GPIO2  (via drill 0.35)
  3v3 0.254: v16.13,107.75 7.92,99.55 7.92,77.78 11.1,74.61 18.03,74.61 20.45,72.19 26.03,72.19 v28.07,74.23
  Bottom 0.254: R23.2 R21.1 36.07,64.53 36.07,70.29 37.32,71.54 U3.4 37.32,72.47 35.56,74.23 v28.07,74.23 | U1.15 14.94,106.56 v16.13,107.75
ESP-RST  (via drill 0.35)
  3v3 0.254: v34.8,67.88 34.8,81.34 27.65,88.49 26.16,88.49 25.58,89.06 25.58,90.55 v17.65,98.61
  Bottom 0.254: v34.8,67.88 34.8,66.23 U3.5 | U1.11 15.88,104.04 15.88,103.32 15.66,103.11 14.91,103.11 14.73,102.93 14.73,100.51 16.76,98.61 v17.65,98.61
ESP-RXD  (via drill 0.35)
  Top 0.254: v26.87,74.2 14.07,87 14.07,100.41 v14.02,100.46
  Bottom 0.254: U3.8 29.08,72.02 26.9,74.2 v26.87,74.2 | U1.12 14.65,104.06 14.02,103.44 v14.02,100.46
ESP-TXD  (via drill 0.35)
  Top 0.254: v24.49,75.11 24.49,75.18 13.61,86.05 13.61,99.37 v13.21,99.78
  Bottom 0.254: 13.53,105.56 U1.13 13.9,104.61 11.58,102.29 11.58,100.31 12.12,99.78 v13.21,99.78 | U3.1 42.42,68.77 42.42,73.34 40.77,74.99 24.64,74.99 24.51,75.11 v24.49,75.11
ESP-VCC  (via drill 0.35)
  3v3 0.254: v51.13,67.91 38.18,67.91 36.23,65.96 27.26,65.96 v27.01,66.22
  Bottom 0.254: U3.7 32.21,66.23 C7.1 28.74,66.31 28.64,66.22 v27.01,66.22 | S2.2 v51.13,67.91
GND  (via drill 0.35)
  Top 0.508: v36.83,18.98 37.92,17.89 H3.GND
  3v3 0.508: v36.83,18.98 36.83,21.01 34.04,23.81 34.04,50.48
  Bottom 0.254: C1.2 24.76,55.81 v25.91,55.81 | R2.1 24.71,58.22 v25.91,58.22 | U2.2 16.87,55.32 C2.2 16.21,53.57 v16.26,53.52 | C7.2 v28.83,69.27 | C9.2 9.82,61.48 v9.91,61.4 | T1.2 7.32,73.41 v7.37,73.46 | C12.2 11.42,112.32 v10.41,111.31 | U1.23 12.18,110.56 v11.94,110.8 | v19.18,100.51 19.16,100.51 C10.2 17.4,102.28 U1.8 | U1.47 23.28,106.06 24.38,104.96 24.38,104 C11.2 v26.03,103.56 | R28.1 29.25,100.73 29.17,100.64 v29.17,100.77 | C6.2 59.36,113.8 59.31,113.85 v59.44,113.85
  Bottom 0.508: U3.2 38.61,70.77 v38.61,63.3 | H1.5 62.67,108.7 62.61,108.64 62.61,109.91 | 62.61,109.91 62.36,109.91 61.34,110.93 61.34,111.44 | H1.3 62.67,109.97 62.61,109.91
  other vias: 15.65,110.55 24.51,97.47 38.48,100.9 21.08,109.4
  pour Bottom (rank 2): 40.41,56.14 40.52,64.22 31.09,64.22 30.38,64.93 30.38,69.32 29.49,70.21 27.1,70.21 25.42,71.89 25.42,98.53 26.09,99.19 49.4,99.19 69.11,118.9 69.11,125.03 66.24,127.9 59.99,127.9 44.91,112.81 31.17,112.81 15.98,128 9.98,128 -1.8,116.21 -1.8,50.32 39.34,50.32 40.41,51.39
  pour 3v3: 40.39,56.14 40.49,64.22 31.06,64.22 30.35,64.93 30.35,69.32 29.46,70.21 27.08,70.21 25.4,71.89 25.4,98.53 26.19,98.56 49.5,98.56 69.09,118.9 69.09,125.03 66.22,127.9 59.97,127.9 44.88,112.81 31.14,112.81 15.95,128 9.96,128 -1.83,116.21 -1.83,50.32 39.32,50.32 40.39,51.39
I2C1_SCL  (via drill 0.35)
  Top 0.254: v38.73,20.73 39.79,19.68 H3.SCL
  Bottom 0.254: 6.61,107.81 6.65,108 6.68,108.18 7.89,114.08 9.89,115.72 18.41,115.29 20.38,113.32 20.38,112.58 U1.35 20.4,111.66 20.78,111.28 21.13,111.28 22.96,113.11 R26.1 | 6.61,107.81 | 6.61,107.81 6.23,105.98 | 6.23,105.98 | 6.23,105.98 5.08,100.36 4.31,96.62 2.47,86.86 1.61,81.2 1.42,78.6 1.28,76.56 1.54,75.32 2.35,71.51 2.99,70.2 4.6,67.47 5.48,66.06 6.64,64.79 7.04,64.4 7.66,64.14 8.23,63.57 8.23,37.52 21.31,24.44 36.93,24.44 38.73,22.64 v38.73,20.73
I2C1_SDA  (via drill 0.35)
  Top 0.254: v36.93,22.59 35.84,23.68 H3.SDA
  Bottom 0.254: U1.36 20.88,112.58 20.88,113.47 18.56,115.79 | 18.56,115.79 9.76,116.23 7.49,114.38 6.2,108.08 3.86,96.7 1.96,86.62 1.89,86.19 1.17,81.41 0.82,76.53 1.91,71.36 2.94,69.26 5.16,65.7 6.05,64.74 6.85,63.94 7.47,63.69 7.77,63.38 7.77,37.37 26.59,18.55 34.67,18.55 36.93,20.81 v36.93,22.59 | R27.1 17.2,117.42 17.2,115.86 18.56,115.79
LED-SEG-A
  Bottom 0.254: D2.1 47.12,98.99 26.29,98.99 25.65,98.36 25.65,97.21 24.77,96.33 R18.2 21.66,97.32 D1.1
LED-SEG-B
  Bottom 0.152: R19.2 51.46,95.03 52.02,94.47 61.27,94.47 D2.18
  Bottom 0.254: 45.97,95.94 45.98,95.95 | 45.98,95.95 R19.2 | 45.98,95.95 45.06,95.95 44.63,96.37 27.86,96.37 D1.18
LED-SEG-C
  Bottom 0.152: D2.16 61.27,89.39 56.49,89.39 55.91,89.97 R15.2
  Bottom 0.254: D1.16 43.33,92.24 44.58,90.99 R15.2
LED-SEG-D
  Bottom 0.254: D1.13 42.06,84.62 43.31,83.37 61.98,83.37 63.19,84.58 D2.13 66.33,84.58 R16.2
LED-SEG-DP
  Bottom 0.254: D1.12 41.55,82.08 42.8,80.83 62.87,80.83 D2.12 68.43,82.04 R20.2
LED-SEG-E
  Bottom 0.254: R17.2 64.14,76.9 64.13,76.9 D2.10 61.6,74.48 49,74.48 46.48,77 D1.10
LED-SEG-F
  Bottom 0.254: D2.9 47.5,78.29 25.15,78.29 23.85,77 D1.9 3.36,77 R12.2
LED-SEG-G
  Bottom 0.254: D2.8 48.77,79.43 42.8,79.43 41.4,80.83 12.98,80.83 D1.8 5.48,79.54 R13.2
LED-SEG-H
  Bottom 0.254: D2.4 44.39,89.66 43.05,90.99 26.16,90.99 23.88,88.71 R14.2 15.39,89.7 D1.4
LED-SEG-K
  Bottom 0.254: D2.3 44.89,92.2 43.56,93.53 25.78,93.53 23.63,91.37 R11.2 17.61,92.24 D1.3
LED-SEG-M
  Bottom 0.254: D2.2 45.66,94.74 44.45,95.94 25.27,95.94 23.12,93.79 R10.2 19.57,94.78 D1.2
LED-SEG-N
  Bottom 0.152: R9.2 53.68,92.55 54.27,91.96 61.3,91.96 D2.17
  Bottom 0.254: D1.17 43.71,94.78 44.96,93.53 R9.2
LED-SEG-P
  Bottom 0.152: R8.2 58.14,87.54 58.83,86.85 61.27,86.85 D2.15
  Bottom 0.254: D1.15 43.08,89.7 44.32,88.45 R8.2
LED-SEG-R
  Bottom 0.254: D1.14 42.69,87.16 43.94,85.91 R7.2 62.87,85.91 D2.14
LED-SEG-S
  Bottom 0.254: D2.6 43.75,84.58 42.42,85.91 25.91,85.91 24.61,84.62 D1.6 9.05,84.62 R6.2
LED-SEG-T
  Bottom 0.254: D2.7 43.12,82.04 41.78,83.37 25.65,83.37 24.36,82.08 D1.7 11.53,82.23 R5.2
LED-SEG-U
  Bottom 0.254: D2.5 44.26,87.12 42.93,88.45 25.78,88.45 23.5,86.17 R4.2 12.67,86.17 D1.5
N$1
  Bottom 0.508: U2.3 16.81,56.27 16.66,56.42 L1.P$1
N$2
  Bottom 0.559: U2.1 18.3,52.4 R3.2
N$3
  Bottom 0.559: R2.2 22.76,58.21 R1.1 20.51,58.24 C3.2
  Bottom 0.635: U2.5 19.53,55.51 19.53,56.87 20.48,57.83 R1.1
N$4
  pour Top: 34.53,40.01 33.88,39.99 33.23,39.94 32.59,39.84 31.95,39.71 31.32,39.55 31.57,39.18 31.8,38.79 32.49,39.02 33.2,39.14 33.92,39.16 34.63,39.07 35.33,38.87 35.99,38.58 36.6,38.19 37.14,37.72 37.65,37.14 38.05,36.48 38.35,35.76 38.53,35.01 38.59,34.24 38.53,33.47 38.35,32.72 38.05,32.01 37.65,31.35 37.14,30.76 36.61,30.3 36.01,29.92 35.37,29.63 34.69,29.44 35.06,28.78 35.33,28.08 35.49,27.34 35.53,26.59 35.46,25.84 35.28,25.11 34.98,24.42 34.58,23.78 34.09,23.21 33.52,22.71 32.88,22.32 32.19,22.02 31.45,21.84 30.7,21.77 29.95,21.81 29.21,21.97 28.51,22.24 27.86,22.62 27.66,21.94 27.37,21.3 26.99,20.7 26.52,20.17 25.97,19.7 25.35,19.31 24.68,19.02 23.98,18.83 23.25,18.74 23.25,14.77 23.26,14.37 23.28,13.97 23.95,13.56 24.58,13.11 25.18,12.61 25.74,12.07 26.26,11.49 26.74,10.88 27.17,10.23 27.55,9.55 27.89,8.85 28.17,8.12 28.4,7.38 28.58,6.62 28.7,5.85 28.76,5.08 29.42,4.71 30.11,4.39 30.82,4.12 31.54,3.89 32.28,3.72 33.02,3.59 33.78,3.52 34.53,3.49 41.01,3.49 41.76,3.52 42.5,3.59 43.24,3.71 43.96,3.88 44.68,4.11 45.37,4.37 46.05,4.69 46.71,5.04 46.76,5.78 46.87,6.5 47.02,7.22 47.23,7.93 47.48,8.62 47.78,9.29 48.12,9.94 48.51,10.56 48.94,11.16 49.41,11.73 49.92,12.26 50.46,12.76 51.03,13.22 51.63,13.64 52.26,14.02 52.29,14.77 52.29,28.73 52.27,29.5 52.19,30.27 52.06,31.03 51.88,31.78 51.65,32.51 51.36,33.23 51.03,33.92 50.66,34.6 50.23,35.24 49.77,35.85 49.26,36.43 48.72,36.98 48.14,37.49 47.52,37.95 46.88,38.37 46.21,38.75 45.51,39.08 44.79,39.37 44.06,39.6 43.31,39.78 42.55,39.91 41.78,39.99 41.01,40.01
N$5
  Top 0.254: 32.25,21.35 33.27,21.35 33.27,20.33
PA15  (via drill 0.35)
  Top 0.254: v65.02,74.1 62.1,77.02 v62.1,82.1
  Bottom 0.254: U1.38 27.42,110.56 30,107.98 50.68,107.98 55.86,102.8 66.88,102.8 68.99,100.7 68.99,87.43 71.16,85.26 71.16,82.41 73.41,80.17 73.41,75.88 71.63,74.1 v65.02,74.1 | R20.1 67.87,83.37 63.37,83.37 v62.1,82.1
PB0
  Bottom 0.254: U1.18 11.11,108.06 10.82,107.77 10.73,107.36 10.41,105.86 9.7,102.47 9.7,99.07 10.13,98.63 12.8,98.63 13.69,97.75 22.17,97.75 R18.1
PB1
  Bottom 0.254: U1.19 13.88,108.54 10.98,108.54 10.42,107.98 10.31,107.45 9.27,102.52 9.27,96.96 10.29,95.94 20.19,95.94 20.45,95.69 R10.1
PB2
  Bottom 0.254: 13.88,109.08 U1.20 13.88,109.04 10.8,109.04 10.04,108.28 9.04,103.59 arc-1 8.81,102.56 8.81,95 10.29,93.53 18.21,93.53 R11.1
PB3
  Bottom 0.254: U1.39 22.42,110.04 27.33,110.04 29.82,107.55 50.5,107.55 55.68,102.37 66.7,102.37 68.55,100.52 68.55,87.26 70.73,85.08 R17.1
PB4
  Bottom 0.254: U1.40 27.2,109.56 29.64,107.12 50.32,107.12 55.5,101.94 66.53,101.94 68.12,100.34 68.12,88.26 R16.1
PB5
  Bottom 0.254: U1.41 27.09,109.06 29.46,106.69 50.14,106.69 55.32,101.51 66.35,101.51 67.69,100.16 67.69,93.53 65.02,90.86 63.41,90.86 R7.1
PB6
  Bottom 0.254: U1.42 26.98,108.56 29.28,106.25 49.96,106.25 55.15,101.07 66.17,101.07 67.26,99.98 67.26,95.64 65.15,93.53 63.63,93.53 60.45,90.35 R8.1
PB7
  Bottom 0.254: U1.43 26.87,108.06 29.1,105.82 49.78,105.82 54.97,100.64 65.99,100.64 66.83,99.8 66.83,97.11 65.79,96.07 63.63,96.07 60.45,92.89 R15.1
PB8
  Bottom 0.254: R9.1 53.68,101.31 49.61,105.39 28.92,105.39 27.25,107.06 U1.45
PB9
  Bottom 0.254: U1.46 27.14,106.56 28.74,104.96 49.43,104.96 51.83,102.56 51.83,98.22 R19.1
PB10
  Bottom 0.254: U1.21 10.71,109.56 9.65,108.5 9.1,106.01 8.82,104.73 | R14.1 16,90.99 10.29,90.99 8.36,92.92 8.36,102.61 8.4,102.79 8.59,103.67 8.74,104.36 | 8.82,104.73 | 8.82,104.73 8.78,104.54 8.74,104.36 | 8.74,104.36
PB11
  Bottom 0.254: U1.22 13.88,110.04 10.54,110.04 9.23,108.73 8.33,104.64 7.9,102.66 7.9,90.71 10.29,88.32 14.03,88.32 R4.1
PB12
  Bottom 0.254: U1.25 15.4,113.23 15.05,113.58 | 15.05,113.58 | 15.05,113.58 13.5,113.66 10.43,113.66 9.68,112.9 7.44,102.7 7.44,88.78 9.68,86.54 R6.1
PB13
  Bottom 0.254: U1.26 15.9,113.54 15.43,114.02 10.4,114.27 9.22,113.09 6.98,102.75 6.98,84.71 R5.1
PB14
  Bottom 0.254: U1.27 16.4,113.95 15.88,114.47 10.27,114.75 10.25,114.74 10.21,114.74 8.76,113.3 6.53,102.8 6.53,85.76 5.45,84.68 R13.1
PB15
  Bottom 0.254: U1.28 16.9,114.09 16.05,114.95 10.04,115.25 8.35,113.86 | 8.35,113.86 8.31,113.82 | R12.1 3.33,83.21 6.07,85.95 6.07,102.88 8.35,113.86
SERVO-CTRL
  Bottom 0.254: T1.1 5.24,70.57 R25.1 6.51,69.46 10.03,72.98 11.93,72.98 H2.3
SERVO-PWM  (via drill 0.35)
  Top 0.254: v12.57,100.67 10.31,98.41 10.31,76.08 11.02,75.37 v12.95,75.37
  Bottom 0.254: v12.57,100.67 12.57,102.67 15.49,105.59 16.38,105.59 17.14,106.36 17.14,106.87 16.87,107.15 16.87,111 17.4,111.54 U1.29 | T1.3 4.27,74.56 5.08,75.37 8.13,75.37 v12.95,75.37
SWCLK
  Bottom 0.254: U1.37 27.53,111.06 30.18,108.41 55.27,108.41 56.82,109.97 H1.4
SWDIO  (via drill 0.35)
  3v3 0.254: v20.95,110.58 22.68,110.58 23.88,111.77 | 23.88,111.77 23.9,111.77 | 23.88,111.77 v23.85,111.77
  Bottom 0.254: U1.34 19.9,111.2 20.45,110.65 20.95,110.65 v20.95,110.58 | v23.85,111.77 27.43,111.77 30.35,108.85 55.09,108.85 57.48,111.24 H1.2
USER_BUTTON  (via drill 0.35)
  gnd 0.254: v21.4,102.18 21.4,99.88 21.7,99.58 28.6,99.58 30.5,97.68 v32.8,97.68 32.9,97.68
  Bottom 0.254: SW1.3 SW1.4 34.87,97.68 v32.8,97.68 | U1.2 20.4,103.18 v21.4,102.18
V2_CHECK
  Bottom 0.254: U1.4 19.42,104.04 19.42,103.15 22.32,100.25 26.6,100.25 R30.2
VBAT
  Bottom 0.254: 6.54,67.56 R25.2 7.52,68.73 7.52,69.32 9.04,70.85 10.46,70.85 11.03,70.28
  Bottom 0.508: 22.85,54.59 R3.1 20.43,51.05 19.91,50.53 13.66,50.53 11.72,52.47 C9.1 11.72,66.26 12.45,66.99 12.45,68.87 11.03,70.28 H2.2
  Bottom 0.559: U2.4 22.41,56.27 C1.1
  Bottom 0.762: C1.1 22.85,54.59 25.15,52.28 28.65,52.28 S1.3
VBATIN
  Bottom 0.762: S1.2 31.2,51.41 32.16,50.45 35.53,50.45 37.46,52.38 H4.1
(copper drawn outside any net)
  shapes: Top area x206

### Text on the board
bPlace: dash | & | tense future | dc26 | v.2 | github.com/SeanLeftBelow/defcon26-meow
bNames: BATT- | BATT+